# Altium schematic sheet Buffer Module.SchDoc
size A4; Organization: TESLA Motors, INC; Address1: 3500 Deer Creek Road; Address2: Palo Alto, CA; Address4: U.S.A.; SheetNumber: 1; SheetTotal: 1
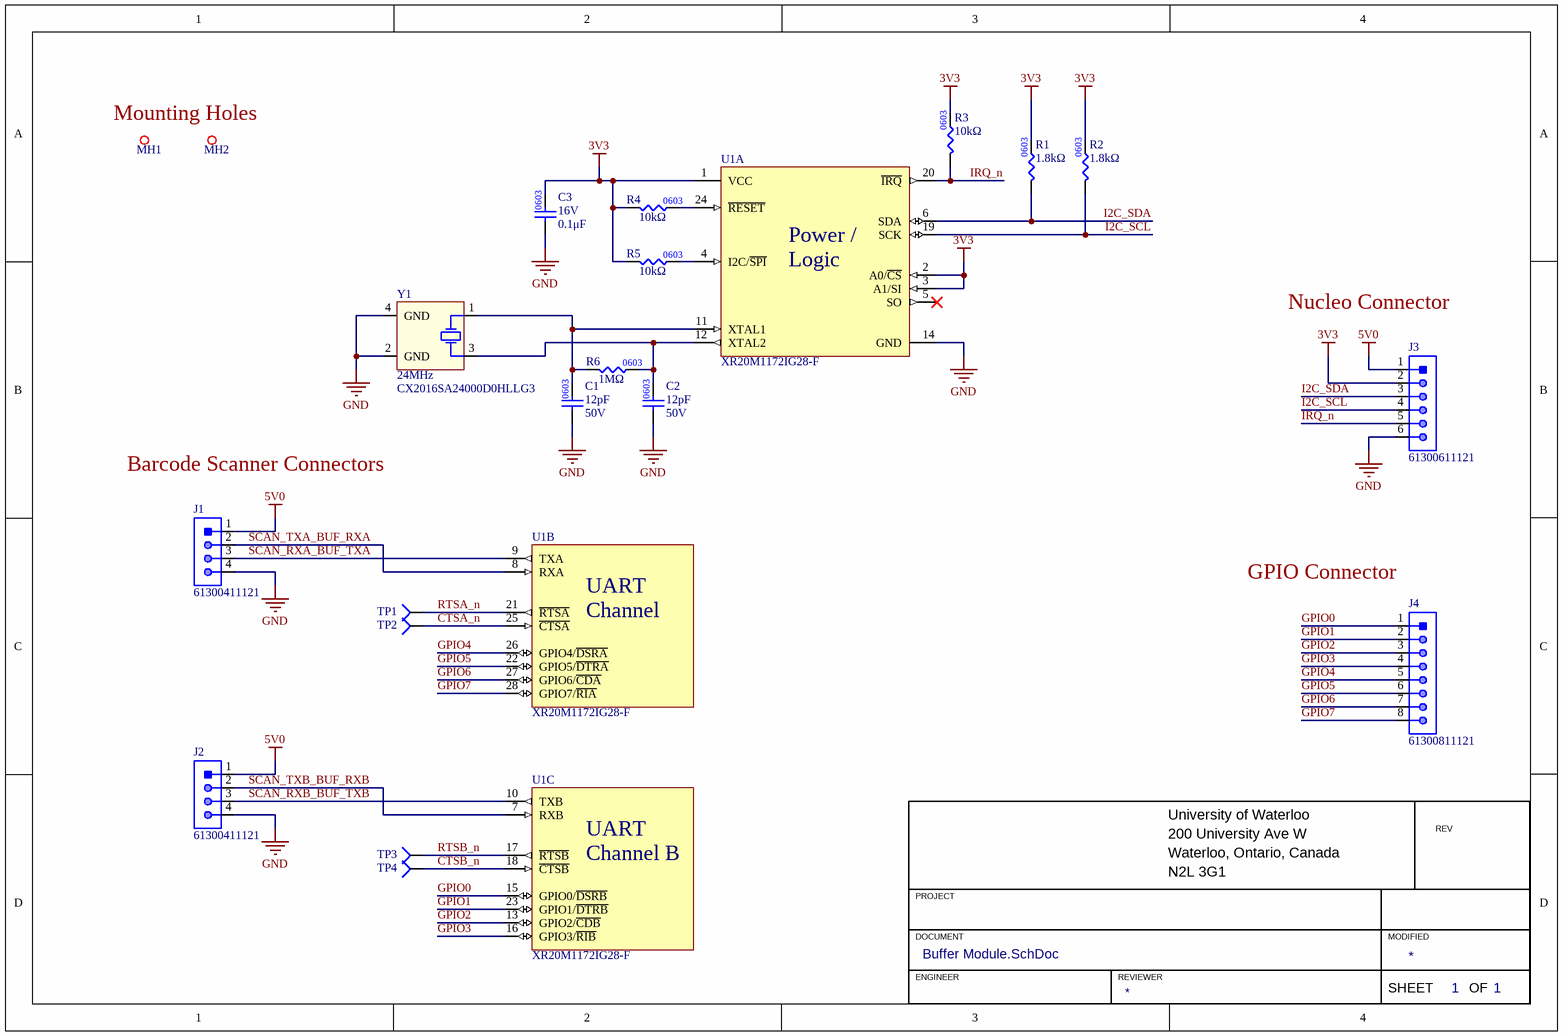
[diagram p0: Buffer Module.SchDoc]

## Parts
C1  value 12pF  Voltage Rating: 50V  [CAP0603]  (hidden comment: CAP_12pF_50V_0603)
C2  value 12pF  Voltage Rating: 50V  [CAP0603]  (hidden comment: CAP_12pF_50V_0603)
C3  value 0.1μF  Voltage Rating: 16V  [CAP0603]  (hidden comment: CAP_0.1uF_16V_0603)
J1  Manufacturer Part Number 1: 61300411121  [HDR1X4]  (hidden comment: HEADER 4x1)
J2  Manufacturer Part Number 1: 61300411121  [HDR1X4]  (hidden comment: HEADER 4x1)
J3  Manufacturer Part Number 1: 61300611121  [HDR1X6]  (hidden comment: HEADER 6x1)
J4  Manufacturer Part Number 1: 61300811121  [HDR1X8]  (hidden comment: HEADER 8x1)
MH1  MOUNTING_HOLE_M3  [MOUNTING_HOLE_3mm]  (value not drawn)  (no BOM)
MH2  MOUNTING_HOLE_M3  [MOUNTING_HOLE_3mm]  (value not drawn)  (no BOM)
R1  value 1.8kΩ  [RES0603]  (hidden comment: RES_1.8kΩ_0603_1%)
R2  value 1.8kΩ  [RES0603]  (hidden comment: RES_1.8kΩ_0603_1%)
R3  value 10kΩ  [RES0603]  (hidden comment: RES_10kΩ_0603_1%)
R4  value 10kΩ  [RES0603]  (hidden comment: RES_10kΩ_0603_1%)
R5  value 10kΩ  [RES0603]  (hidden comment: RES_10kΩ_0603_1%)
R6  value 1MΩ  [RES0603]  (hidden comment: RES_1MΩ_0603_1%)
TP1  TESTPOINT_1MM_CIRCLE  [TESTPOINT_CIRCLE_1MM]  (value not drawn)  (no BOM)
TP2  TESTPOINT_1MM_CIRCLE  [TESTPOINT_CIRCLE_1MM]  (value not drawn)  (no BOM)
TP3  TESTPOINT_1MM_CIRCLE  [TESTPOINT_CIRCLE_1MM]  (value not drawn)  (no BOM)
TP4  TESTPOINT_1MM_CIRCLE  [TESTPOINT_CIRCLE_1MM]  (value not drawn)  (no BOM)
U1  XR20M1172IG28-F  [MAX_28-TSSOP]  (parts A,B,C of 3)
Y1  Frequency: 24MHz  Manufacturer Part Number 1: CX2016SA24000D0HLLG3  [XTAL_KYOCERA_CX2016SA]  (hidden comment: CRYSTAL_25MHZ)

## Nets
3V3: C3.2 J3.2 R1.2 R2.2 R3.2 R4.1 R5.1 U1.1(VCC) U1.2(A0/~{CS}) U1.3(A1/SI)
5V0: J1.1 J2.1 J3.1
GND: C1.1 C2.1 C3.1 J1.4 J2.4 J3.6 U1.14(GND) Y1.2(GND) Y1.4(GND)
CTSA_n: TP2.1(=value) U1.25(~{CTSA})
CTSB_n: TP4.1(=value) U1.18(~{CTSB})
GPIO0: J4.1 U1.15(GPIO0/~{DSRB})
GPIO1: J4.2 U1.23(GPIO1/~{DTRB})
GPIO2: J4.3 U1.13(GPIO2/~{CDB})
GPIO3: J4.4 U1.16(GPIO3/~{RIB})
GPIO4: J4.5 U1.26(GPIO4/~{DSRA})
GPIO5: J4.6 U1.22(GPIO5/~{DTRA})
GPIO6: J4.7 U1.27(GPIO6/~{CDA})
GPIO7: J4.8 U1.28(GPIO7/~{RIA})
I2C_SCL: J3.4 R2.1 U1.19(SCK)
I2C_SDA: J3.3 R1.1 U1.6(SDA)
IRQ_n: J3.5 R3.1 U1.20(~{IRQ})
RTSA_n: TP1.1(=value) U1.21(~{RTSA})
RTSB_n: TP3.1(=value) U1.17(~{RTSB})
SCAN_RXA_BUF_TXA: J1.3 U1.9(TXA)
SCAN_RXB_BUF_TXB: J2.3 U1.10(TXB)
SCAN_TXA_BUF_RXA: J1.2 U1.8(RXA)
SCAN_TXB_BUF_RXB: J2.2 U1.7(RXB)
NetC1_2: C1.2 R6.1 U1.11(XTAL1) Y1.1(HOT)
NetC2_2: C2.2 R6.2 U1.12(XTAL2) Y1.3(HOT)
NetR4_2: R4.2 U1.24(~{RESET})
NetR5_2: R5.2 U1.4(I2C/~{SPI})

Not connected (* = marked no-connect by the designer): U1 5(SO)*

## Notes on the sheet
- Mounting Holes
- Nucleo Connector
- Barcode Scanner Connectors
- (near J4) GPIO Connector
- University of Waterloo
- 200 University Ave W
- REV
- PROJECT
- Waterloo, Ontario, Canada
- N2L 3G1
- DOCUMENT
- ENGINEER
- REVIEWER
- MODIFIED
- SHEET
- OF
- (in symbol XR20M1172IG28-F, part A) Power / / Logic
- (in symbol XR20M1172IG28-F, part B) UART / Channel A
- (in symbol XR20M1172IG28-F, part C) UART / Channel B

## Library data of the parts
C1 C2 = CAP_12pF_50V_0603: CAP CER 12PF 50V C0G/NP0 0603; Manufacturer Part Number 1: C0603C120J5GACTU; Manufacturer 1: KEMET; Package/Footprint: 0603; Dielectric: C0G, NP0; Supplier Part Number 1: 399-C0603C120J5GACTUCT-ND; Supplier 1: Digi-Key; Mounting Type: SMD
C3 = CAP_0.1uF_16V_0603: CAP CER 0.1UF 16V X7R 0603; Manufacturer Part Number 1: CC0603KRX7R7BB104; Manufacturer 1: Yageo; Package: 0603; Supplier Part Number 1: 311-1088-1-ND; Supplier 1: Digi-Key; Dielectric: X7R
J1 J2 = HEADER 4x1: CONN HEADER VERT 4POS 2.54MM; Manufacturer 1: Würth Elektronik; Mounting Type: TH; Pitch: 2.54mm; Supplier 1: Digikey; Supplier Part Number 1: 732-5317-ND
J3 = HEADER 6x1: CONN HEADER VERT 6POS 2.54MM; Manufacturer 1: Würth Elektronik; Supplier 1: Digi-Key; Mounting Type: TH; Pitch: 2.54mm; Supplier Part Number 1: 732-5319-ND
J4 = HEADER 8x1: CONN HEADER VERT 8POS 2.54MM; Manufacturer 1: Würth Elektronik; Mounting Type: TH; Pitch: 2.54mm; Supplier 1: Digikey; Supplier Part Number 1: 732-5321-ND
R1 R2 = RES_1.8kΩ_0603_1%: RES 1.8K OHM 1% 1/10W 0603; Manufacturer 1: Yageo; Manufacturer Part Number 1: RC0603FR-071K8L; Package: 0603; Supplier 1: Digikey; Supplier Part Number 1: 311-1.80KHRCT-ND
R3-R5 = RES_10kΩ_0603_1%: RES 10K OHM 1% 1/8W 0603; Manufacturer 1: Stackpole Electronics Inc; Manufacturer Part Number 1: RNCP0603FTD10K0; Supplier Part Number 1: RNCP0603FTD10K0CT-ND; Supplier 1: Digi-Key; Mounting Type: SMD; Package: 0603
R6 = RES_1MΩ_0603_1%: RES 1M OHM 1% 1/10W 0603; Manufacturer 1: YAGEO; Manufacturer Part Number 1: RC0603FR-071ML; Supplier Part Number 1: 311-1.00MHRCT-ND; Supplier 1: Digi-Key; Mounting Type: SMD; Package: 0603
TP1-TP4 = TESTPOINT_1MM_CIRCLE: TESTPOINT 1MM CIRCLE
U1 = XR20M1172IG28-F: IC UART FIFO I2C/SPI 64B 28TSSOP; Manufacturer 1: MaxLinear, Inc.; Manufacturer Part Number 1: XR20M1172IG28-F; Footprint: 28-TSSOP; Supplier 1: Digikey; Supplier Part Number 1: 1016-1298-5-ND
Y1 = CRYSTAL_24MHZ_8PF: 2.0MM X 1.6MM CRYSTAL 24MHZ 8PF; Manufacturer 1: Kyocera AVX; Package/Footprint: SMD; Mounting Type: SMD; Load Capacitance: 8pF; Supplier 1: Digikey; Supplier Part Number 1: 478-CX2016SA24000D0HLLG3CT-ND